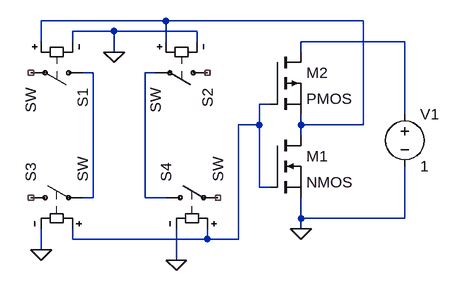
[diagram p0: schematic Draft2.asc]
Draft2.asc, the LTspice schematic file:
Version 4
SHEET 1 880 680
WIRE 160 0 -32 0
WIRE 464 0 160 0
WIRE 80 16 16 16
WIRE 208 16 80 16
WIRE -32 32 -32 0
WIRE 16 32 16 16
WIRE 160 32 160 0
WIRE 208 32 208 16
WIRE 528 32 368 32
WIRE 80 48 80 16
WIRE 368 48 368 32
WIRE 48 80 32 80
WIRE 144 80 128 80
WIRE 320 128 304 128
WIRE 528 144 528 32
WIRE 304 160 304 128
WIRE 304 160 272 160
WIRE 368 160 368 144
WIRE 464 160 464 0
WIRE 464 160 368 160
WIRE 368 176 368 160
WIRE 304 256 304 160
WIRE 320 256 304 256
WIRE 48 272 48 80
WIRE 48 272 32 272
WIRE 128 272 128 80
WIRE 160 272 128 272
WIRE 368 304 368 272
WIRE 528 304 528 224
WIRE 528 304 368 304
WIRE 368 320 368 304
WIRE 16 336 16 320
WIRE 224 336 224 320
WIRE 224 336 16 336
WIRE 272 336 272 160
WIRE 272 336 224 336
WIRE -32 352 -32 320
WIRE 176 368 176 320
FLAG 368 320 0
FLAG -32 352 0
FLAG 176 368 0
FLAG 80 48 0
SYMBOL voltage 528 128 R0
WINDOW 123 0 0 Left 2
WINDOW 39 0 0 Left 2
SYMATTR InstName V1
SYMATTR Value 1
SYMBOL nmos 320 176 R0
SYMATTR InstName M1
SYMBOL pmos 320 48 R0
SYMATTR InstName M2
SYMBOL sw 48 80 R90
SYMATTR InstName S1
SYMBOL sw 240 80 R90
SYMATTR InstName S2
SYMBOL sw -64 272 R270
SYMATTR InstName S3
SYMBOL sw 144 272 R270
SYMATTR InstName S4

The netlist it stands for:
* Draft2.asc
V1 N002 0 1
M1 N001 N005 0 0 NMOS
M2 N002 N005 N001 N001 PMOS
S1 N003 NC_01 N001 0 SW
S2 NC_02 N004 N001 0 SW
S3 NC_03 N003 N005 0 SW
S4 N004 NC_04 N005 0 SW
.model NMOS NMOS
.model PMOS PMOS
.lib standard.mos
.backanno
.end